# EAGLE design Schaltplan (EAGLE 7.3.0)
MAKER: Kevin Luedemann
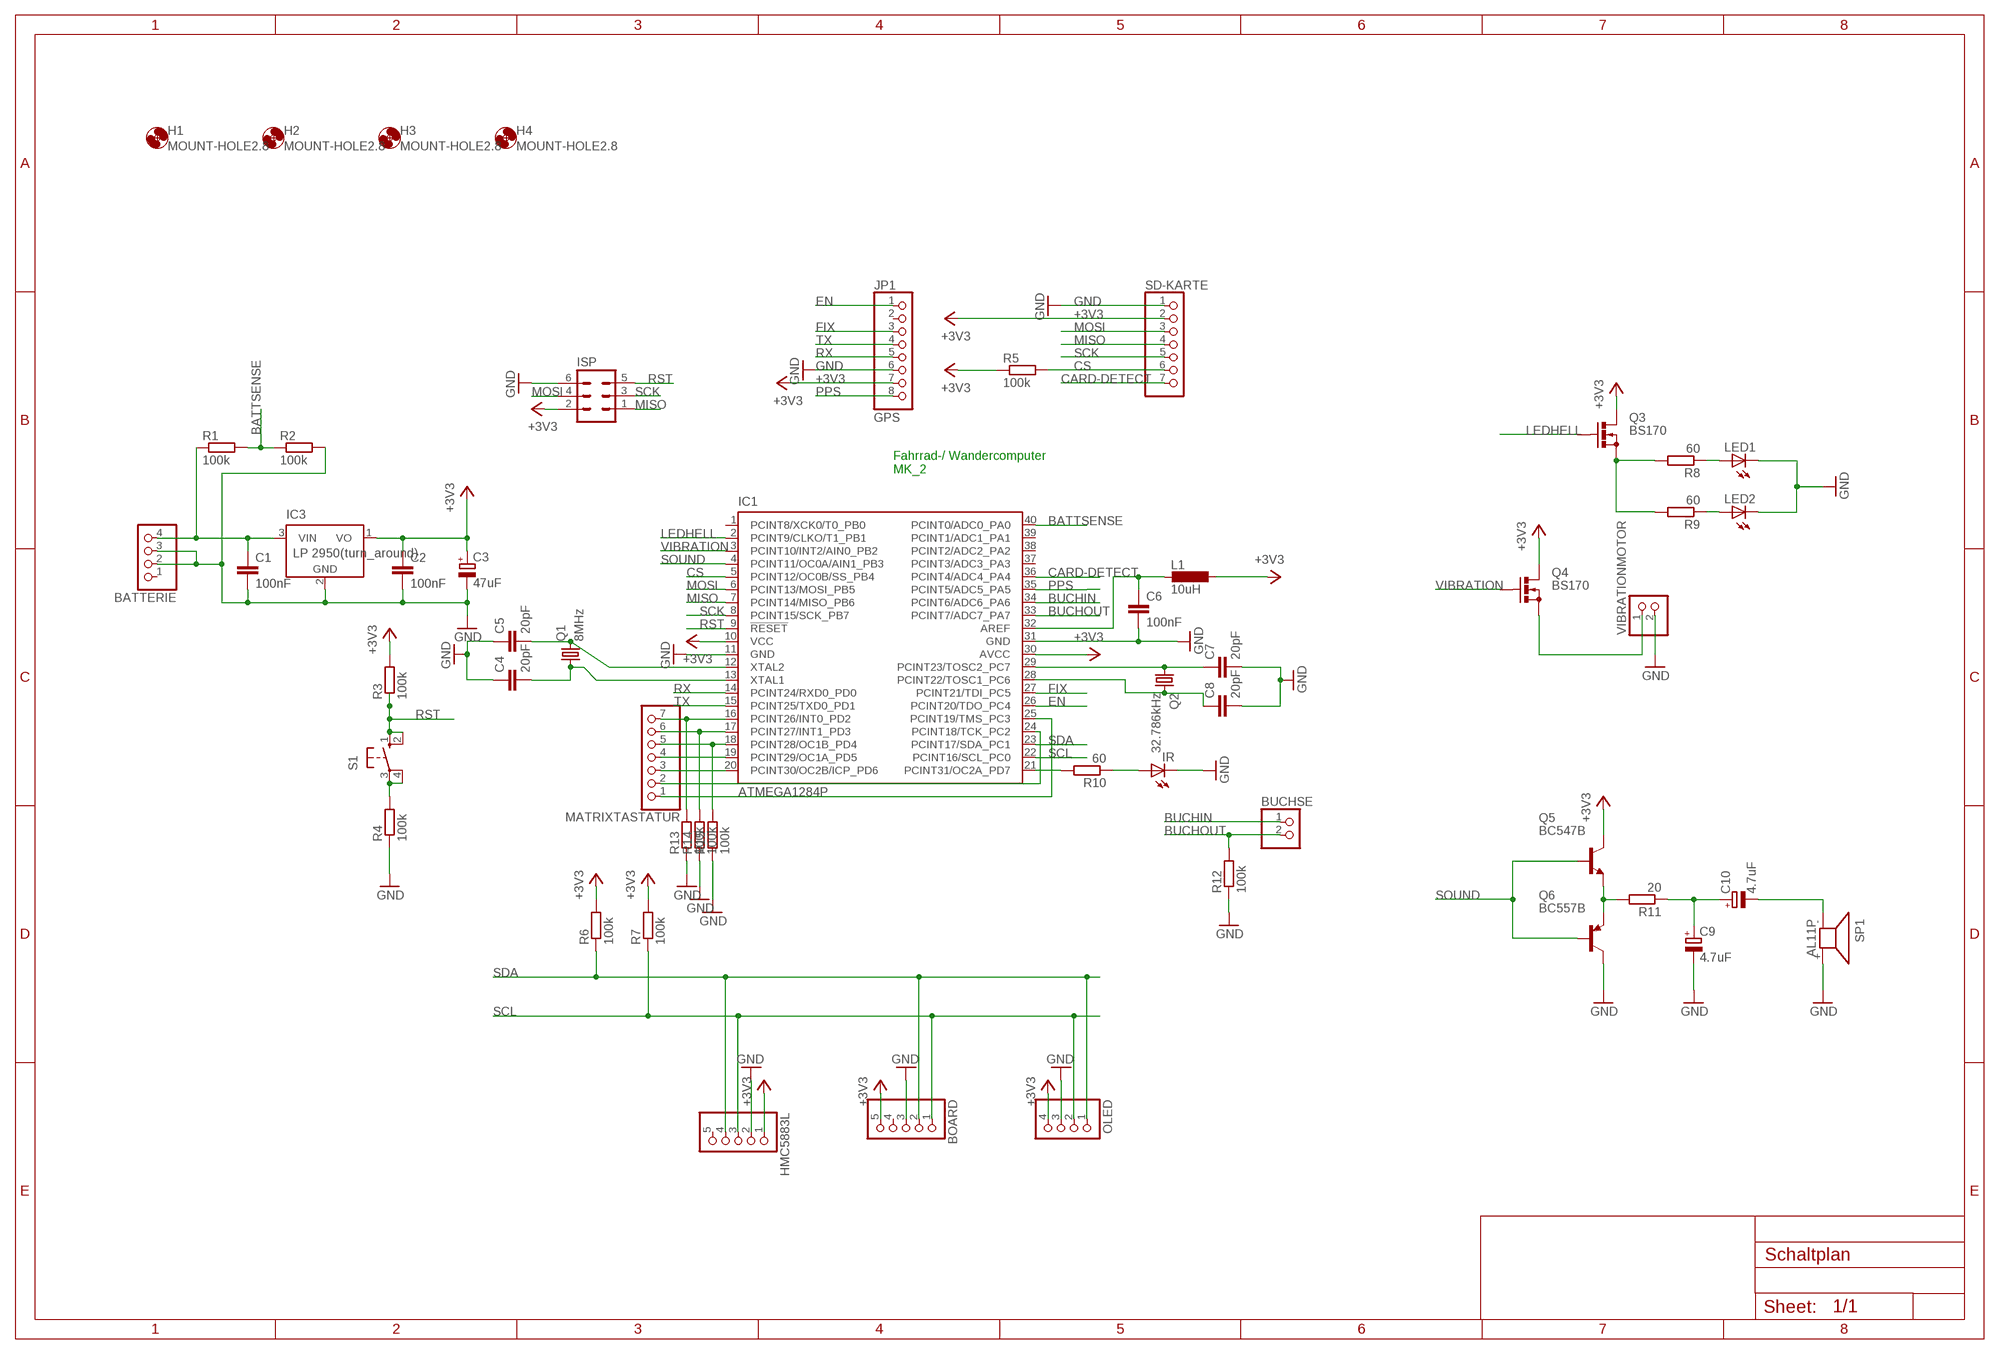
[diagram p0: schematic, sheet 1]

## Parts
BATTERIE  PINHD-1X4  [1X04]
BOARD  PINHD-1X5  [1X05]
BUCHSE  PINHD-1X2  [1X02]
C1  100nF  C-EU025-024X044  [C025-024X044]
C2  100nF  C-EU025-024X044  [C025-024X044]
C3  47uF  CPOL-EUE2.5-6  [E2,5-6]
C4  20pF  C-EU025-024X044  [C025-024X044]
C5  20pF  C-EU025-024X044  [C025-024X044]
C6  100nF  C-EU025-024X044  [C025-024X044]
C7  20pF  C-EU025-024X044  [C025-024X044]
C8  20pF  C-EU025-024X044  [C025-024X044]
C9  4.7uF  CPOL-EUE2.5-6  [E2,5-6]
C10  4.7uF  CPOL-EUE2.5-6  [E2,5-6]
H1  MOUNT-HOLE2.8  [2,8]
H2  MOUNT-HOLE2.8  [2,8]
H3  MOUNT-HOLE2.8  [2,8]
H4  MOUNT-HOLE2.8  [2,8]
HMC5883L  PINHD-1X5  [1X05]
IC1  ATMEGA1284P  ATMEGA644-20PU  [DIL40]
IC3  LP 2950(turn_around)  LM2936Z-3.0  [TO92]
IR  LED3MM  [LED3MM]
ISP  ML6  [ML6]
JP1  GPS  PINHD-1X8  [1X08]
L1  10uH  L-EU0207/10  [0207/10]
LED1  LED5MM  [LED5MM]
LED2  LED5MM  [LED5MM]
MATRIXTASTATUR  PINHD-1X7  [1X07]
OLED  PINHD-1X4  [1X04]
Q1  8MHz  CRYSTALHC49S  [HC49/S]
Q2  32.786kHz  CRYSTALTC26V  [TC26V]
Q3  BS170  [SOT54E]
Q4  BS170  [SOT54E]
Q5  BC547B  [TO92]
Q6  BC557B  [TO92-EBC]
R1  100k  R-EU_0207/10  [0207/10]
R2  100k  R-EU_0207/10  [0207/10]
R3  100k  R-EU_0207/10  [0207/10]
R4  100k  R-EU_0207/10  [0207/10]
R5  100k  R-EU_0207/10  [0207/10]
R6  100k  R-EU_0207/10  [0207/10]
R7  100k  R-EU_0207/10  [0207/10]
R8  60  R-EU_0207/10  [0207/10]
R9  60  R-EU_0207/10  [0207/10]
R10  60  R-EU_0207/10  [0207/10]
R11  20  R-EU_0207/10  [0207/10]
R12  100k  R-EU_0207/10  [0207/10]
R13  100k  R-EU_0207/10  [0207/10]
R14  100k  R-EU_0207/10  [0207/10]
R15  100k  R-EU_0207/10  [0207/10]
S1  10-XX  [B3F-10XX]
SD-KARTE  PINHD-1X7  [1X07]
SP1  AL11P  [AL11P]
VIBRATIONMOTOR  PINHD-1X2  [1X02]

## Nets
+3V3: BOARD.5 C2.1 C3.+ HMC5883L.1 IC1.10(VCC) IC1.30(AVCC) IC3.1(VO) ISP.2 JP1.7 L1.1 OLED.4 Q3.D Q4.D Q5.3(C) R3.2 R5.1 R6.2 R7.2 SD-KARTE.2
BATTSENSE: IC1.40(PCINT0/ADC0_PA0) R1.2 R2.1
BUCHIN: BUCHSE.1 IC1.34(PCINT6/ADC6_PA6)
BUCHOUT: BUCHSE.2 IC1.33(PCINT7/ADC7_PA7) R12.2
CARD-DETECT: IC1.36(PCINT4/ADC4_PA4) SD-KARTE.7
CS: IC1.5(PCINT12/OC0B/SS_PB4) R5.2 SD-KARTE.6
EN: IC1.26(PCINT20/TDO_PC4) JP1.1
FIX: IC1.27(PCINT21/TDI_PC5) JP1.3
GND: BATTERIE.2 BATTERIE.3 BOARD.3 C1.2 C2.2 C3.- C4.1 C5.1 C6.2 C7.2 C8.2 C9.- HMC5883L.2 IC1.11(GND) IC1.31(GND) IC3.2(GND) IR.K(C) ISP.6 JP1.6 LED1.K(C) LED2.K(C) OLED.3 Q6.C R2.2 R4.1 R12.1 R13.1 R14.1 R15.1 SD-KARTE.1 SP1.+ VIBRATIONMOTOR.2
LEDHELL: IC1.2(PCINT9/CLKO/T1_PB1) Q3.G
MISO: IC1.7(PCINT14/MISO_PB6) ISP.1 SD-KARTE.4
MOSI: IC1.6(PCINT13/MOSI_PB5) ISP.4 SD-KARTE.3
N$1: BATTERIE.4 C1.1 IC3.3(VIN) R1.1
N$2: C5.2 IC1.12(XTAL2) Q1.2
N$3: C7.1 IC1.29(PCINT23/TOSC2_PC7) Q2.1
N$4: C4.2 IC1.13(XTAL1) Q1.1
N$5: C8.1 IC1.28(PCINT22/TOSC1_PC6) Q2.2
N$6: R4.2 S1.3(P) S1.4(P1)
N$7: Q3.S R8.2 R9.2
N$8: C6.1 IC1.32(AREF) L1.2
N$9: LED1.A R8.1
N$10: LED2.A R9.1
N$11: IC1.16(PCINT26/INT0_PD2) MATRIXTASTATUR.7 R13.2
N$12: IC1.17(PCINT27/INT1_PD3) MATRIXTASTATUR.6 R14.2
N$13: IC1.18(PCINT28/OC1B_PD4) MATRIXTASTATUR.5 R15.2
N$14: Q4.S VIBRATIONMOTOR.1
N$15: IC1.19(PCINT29/OC1A_PD5) MATRIXTASTATUR.4
N$16: IC1.20(PCINT30/OC2B/ICP_PD6) MATRIXTASTATUR.3
N$17: IC1.24(PCINT18/TCK_PC2) MATRIXTASTATUR.2
N$18: IC1.25(PCINT19/TMS_PC3) MATRIXTASTATUR.1
N$19: IC1.21(PCINT31/OC2A_PD7) R10.2
N$20: IR.A R10.1
N$21: Q5.1(E) Q6.E R11.2
N$22: C9.+ C10.+ R11.1
N$23: C10.- SP1.-
PPS: IC1.35(PCINT5/ADC5_PA5) JP1.8
RST: IC1.9(!RESET) ISP.5 R3.1 S1.1(S) S1.2(S1)
RX: IC1.14(PCINT24/RXD0_PD0) JP1.5
SCK: IC1.8(PCINT15/SCK_PB7) ISP.3 SD-KARTE.5
SCL: BOARD.1 HMC5883L.3 IC1.22(PCINT16/SCL_PC0) OLED.2 R7.1
SDA: BOARD.2 HMC5883L.4 IC1.23(PCINT17/SDA_PC1) OLED.1 R6.1
SOUND: IC1.4(PCINT11/OC0A/AIN1_PB3) Q5.2(B) Q6.B
TX: IC1.15(PCINT25/TXD0_PD1) JP1.4
VIBRATION: IC1.3(PCINT10/INT2/AIN0_PB2) Q4.G
Unconnected: BATTERIE.1 BOARD.4 HMC5883L.5 IC1.1(PCINT8/XCK0/T0_PB0) IC1.37(PCINT3/ADC3_PA3) IC1.38(PCINT2/ADC2_PA2) IC1.39(PCINT1/ADC1_PA1) JP1.2

## Notes on the sheet
- Fahrrad-/ Wandercomputer
  MK_2

## Library data of the parts
BATTERIE OLED = pinhead:PINHD-1X4: PIN HEADER
BOARD HMC5883L = pinhead:PINHD-1X5: PIN HEADER
BUCHSE VIBRATIONMOTOR = pinhead:PINHD-1X2: PIN HEADER
C1 C2 C4-C8 = rcl:C-EU: CAPACITOR, European symbol
C3 C9 C10 = rcl:CPOL-EU: POLARIZED CAPACITOR, European symbol
H1-H4 = holes:MOUNT-HOLE: MOUNTING HOLE with drill center marker
IC1 = atmel:ATMEGA644-*PU: 8-bit Microcontroller with 64K Bytes In-System Programmable Flash Auto generated by make-symbol-device-package-bsdl.ulp Rev. 34 Source: http://www.atmel.com/dyn/resources/prod_documents/doc2593.pdf; MPN: ATMEGA644-20PU; OC_FARNELL: 1288340; OC_NEWARK: 23M5060
IC3 = national-semiconductor:LM2936?*: Ultra-Low Quiescent Current LDO Voltage Regulator Source: Data sheet <http://www.national.com/ds/LM/LM2936.pdf>; MF: NATIONAL SEMICONDUCTOR; MPN: LM2936Z-3.0/NOPB; OC_FARNELL: 1312709; OC_NEWARK: 41K4531
IR LED1 LED2 = led:LED: LED OSRAM: - CHIPLED LG R971, LG N971, LY N971, LG Q971, LY Q971, LO R971, LY R971 LH N974, LH R974 LS Q976, LO Q976, LY Q976 LO Q996 - Hyper CHIPLED LW Q18S LB Q993, LB Q99A, LB R99A - SideLED LS A670, LO A670, LY A670, LG A670, LP A670 LB A673, LV A673, LT A673, LW A673 LH A674 LY A675 LS A676, LA A676, LO A676, LY A676, LW A676 LS A679, LY A679, LG A679 - Hyper Micro SIDELED® LS Y876, LA Y876, LO Y876, LY Y876 LT Y87S - SmartLED LW L88C, LW L88S LB L89C, LB L89S, LG L890 LS L89K, LO L89K, LY L89K LS L896, LA L896, LO L896, LY L896 - TOPLED LS T670, LO T670, LY T670, LG T670, LP T670 LSG T670, LSP T670, LSY T670, LOP T670, LYG T670 LG T671, LOG T671, LSG T671 LB T673, LV T673, LT T673, LW T673 LH T674 LS T676, LA T676, LO T676, LY T676, LB T676, LH T676, LSB T676, LW T676 LB T67C, LV T67C, LT T67C, LS T67K, LO T67K, LY T67K, LW E67C LS E67B, LA E67B, LO E67B, LY E67B, LB E67C, LV E67C, LT E67C LW T67C LS T679, LY T679, LG T679 LS T770, LO T770, LY T770, LG T770, LP T770 LB T773, LV T773, LT T773, LW T773 LH T774 LS E675, LA E675, LY E675, LS T675 LS T776, LA T776, LO T776, LY T776, LB T776 LHGB T686 LT T68C, LB T68C - Hyper Mini TOPLED® LB M676 - Mini TOPLED Santana® LG M470 LS M47K, LO M47K, LY M47K Source: http://www.osram.convergy.de LUXEON: - LUMILED® LXK2-PW12-R00, LXK2-PW12-S00, LXK2-PW14-U00, LXK2-PW14-V00 LXK2-PM12-R00, LXK2-PM12-S00, LXK2-PM14-U00 LXK2-PE12-Q00, LXK2-PE12-R00, LXK2-PE12-S00, LXK2-PE14-T00, LXK2-PE14-U00 LXK2-PB12-K00, LXK2-PB12-L00, LXK2-PB12-M00, LXK2-PB14-N00, LXK2-PB14-P00, LXK2-PB14-Q00 LXK2-PR12-L00, LXK2-PR12-M00, LXK2-PR14-Q00, LXK2-PR14-R00 LXK2-PD12-Q00, LXK2-PD12-R00, LXK2-PD12-S00 LXK2-PH12-R00, LXK2-PH12-S00 LXK2-PL12-P00, LXK2-PL12-Q00, LXK2-PL12-R00 Source: www.luxeon.com KINGBRIGHT: KA-3528ASYC Source: www.kingbright.com
ISP = con-ml:ML6: HARTING; OC_FARNELL: unknown; OC_NEWARK: unknown
JP1 = pinhead:PINHD-1X8: PIN HEADER
L1 = rcl:L-EU: INDUCTOR, European symbol
MATRIXTASTATUR SD-KARTE = pinhead:PINHD-1X7: PIN HEADER
Q1 = crystal:CRYSTAL: CRYSTAL; OC_FARNELL: 1667008; OC_NEWARK: unknown
Q2 = crystal:CRYSTAL: CRYSTAL; OC_FARNELL: unknown; OC_NEWARK: unknown
Q3 Q4 = transistor-small-signal:BS170: N-CHANNEL MOS FET
Q5 = transistor-npn:BC547*: NPN Transistor
Q6 = transistor-pnp:BC557*: PNP Transistror
R1-R15 = rcl:R-EU_: RESISTOR, European symbol
S1 = switch-omron:10-XX: OMRON SWITCH; MPN: B3F-1000; OC_FARNELL: 176432; OC_NEWARK: 36M3542
SP1 = buzzer:AL11P: SPEAKER Source: Buerklin; OC_FARNELL: unknown; OC_NEWARK: unknown

## Board
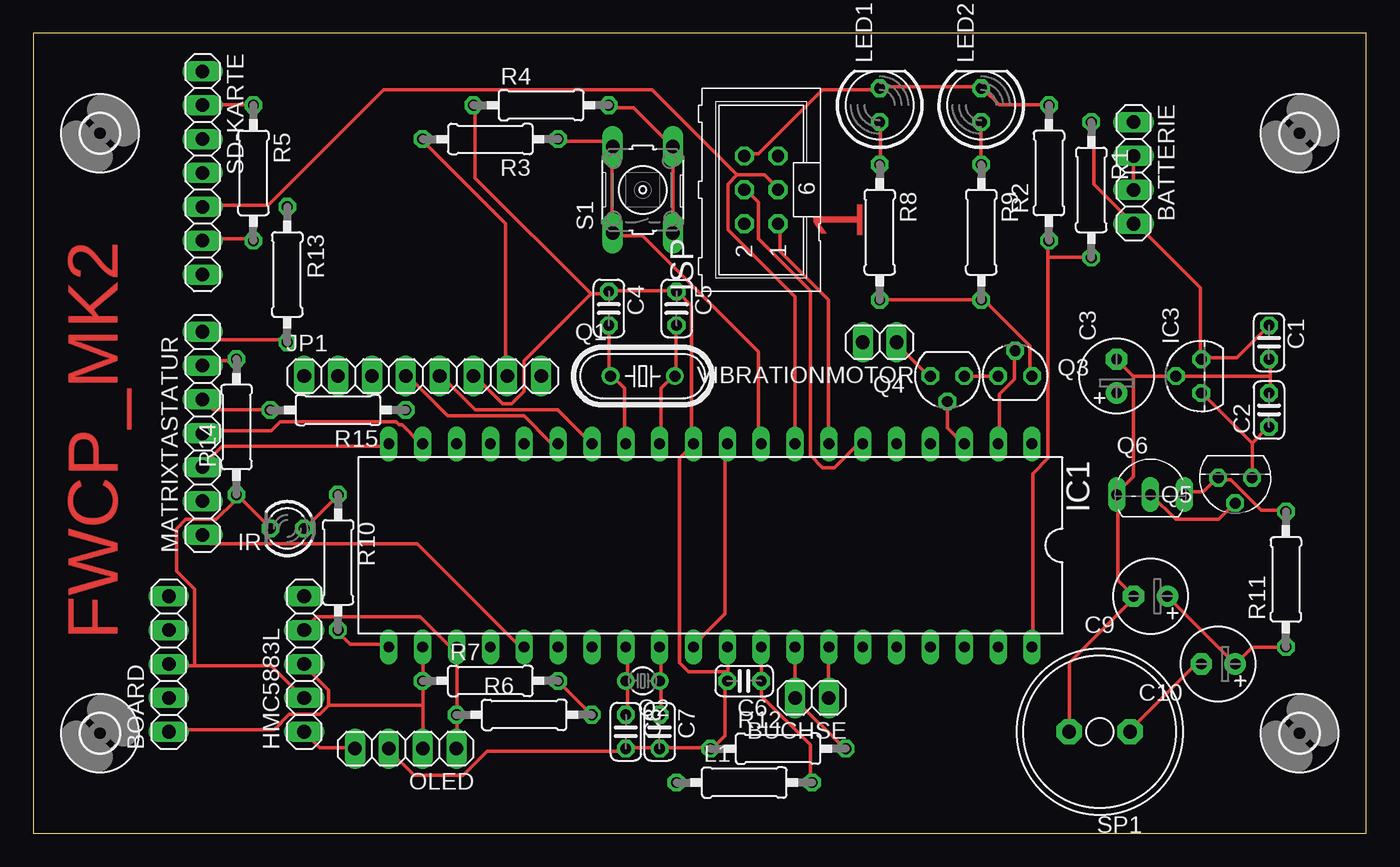
[diagram p1: board, top side]
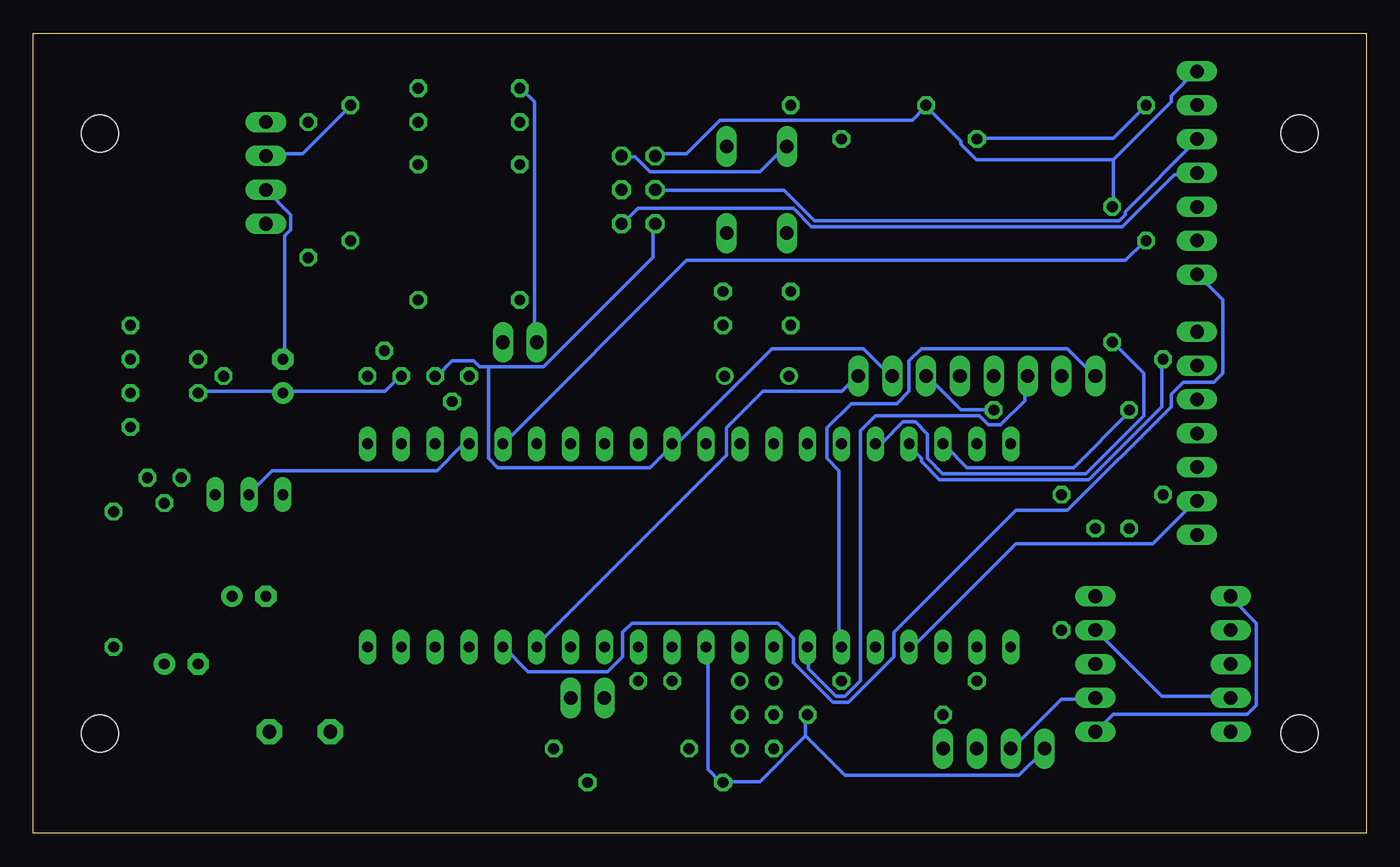
[diagram p2: board, bottom side, seen from below]

Size 100 x 60 mm. Coordinates in mm from the lower left corner, seen from the top.
Outline: 0,0 100,0 100,60 0,60 0,0
Copper layers (1*16): Top 0.035mm / dielectric 1.5mm / Bottom 0.035mm
Design rules "default": minimum track width 10mil, minimum drill 24mil, track to track 8mil, track to pad 8mil, pad to pad 8mil, via to via 8mil, smd to smd 8mil, copper to edge 40mil, drill to drill 8mil, minimum pad ring 10mil, minimum via ring 8mil, stop-mask expansion 4mil, vias tented up to drill 0mil, thermal gap 10mil

### Footprints (pad centres in the part's own frame; a part is rotated, then mirrored left to right if it is on the bottom)
1X04 = drill 1.016 long: 1 -3.81,0; 2 -1.27,0; 3 1.27,0; 4 3.81,0
1X05 = drill 1.016 long: 1 -5.08,0; 2 -2.54,0; 3 0,0; 4 2.54,0; 5 5.08,0
1X02 = drill 1.016 long: 1 -1.27,0; 2 1.27,0
C025-024X044 = drill 0.813 octagon: 1 -1.27,0; 2 1.27,0
E2,5-6 = drill 0.813 pad 1.6: + -1.27,0 | drill 0.813 pad 1.6 octagon: - 1.27,0
2,8 = hole 2.8: 0,0
DIL40 = drill 0.813 long: 1 -24.13,-7.62; 2 -21.59,-7.62; 3 -19.05,-7.62; 4 -16.51,-7.62; 5 -13.97,-7.62; 6 -11.43,-7.62; 7 -8.89,-7.62; 8 -6.35,-7.62; 9 -3.81,-7.62; 10 -1.27,-7.62; 11 1.27,-7.62; 12 3.81,-7.62; 13 6.35,-7.62; 14 8.89,-7.62; 15 11.43,-7.62; 16 13.97,-7.62; 17 16.51,-7.62; 18 19.05,-7.62; 19 21.59,-7.62; 20 24.13,-7.62; 21 24.13,7.62; 22 21.59,7.62; 23 19.05,7.62; 24 16.51,7.62; 25 13.97,7.62; 26 11.43,7.62; 27 8.89,7.62; 28 6.35,7.62; 29 3.81,7.62; 30 1.27,7.62; 31 -1.27,7.62; 32 -3.81,7.62; 33 -6.35,7.62; 34 -8.89,7.62; 35 -11.43,7.62; 36 -13.97,7.62; 37 -16.51,7.62; 38 -19.05,7.62; 39 -21.59,7.62; 40 -24.13,7.62
TO92 = drill 0.813 pad 1.27 octagon: 1 -1.27,0; 2 0,1.905; 3 1.27,0
LED3MM = drill 0.813 octagon: A -1.27,0; K 1.27,0
ML6 = drill 0.914 octagon: 1 -2.54,-1.27; 2 -2.54,1.27; 3 0,-1.27; 4 0,1.27; 5 2.54,-1.27; 6 2.54,1.27
1X08 = drill 1.016 long: 1 -8.89,0; 2 -6.35,0; 3 -3.81,0; 4 -1.27,0; 5 1.27,0; 6 3.81,0; 7 6.35,0; 8 8.89,0
0207/10 = drill 0.813 octagon: 1 -5.08,0; 2 5.08,0
LED5MM = drill 0.813 octagon: A -1.27,0; K 1.27,0
1X07 = drill 1.016 long: 1 -7.62,0; 2 -5.08,0; 3 -2.54,0; 4 0,0; 5 2.54,0; 6 5.08,0; 7 7.62,0
HC49/S = drill 0.813: 1 -2.413,0; 2 2.413,0
TC26V = drill 0.813: 1 -1.27,0; 2 1.27,0
SOT54E = drill 0.813 octagon: D -1.27,0; G 0,1.905; S 1.27,0
TO92' = drill 0.813 octagon: 1 1.27,0; 2 0,1.905; 3 -1.27,0
TO92-EBC = drill 0.813 long: B 0,-1.27; C -2.54,-1.27; E 2.54,-1.27
B3F-10XX = drill 1.016 long: 1 -3.251,2.261; 2 3.251,2.261; 3 -3.251,-2.261; 4 3.251,-2.261
AL11P = drill 1.016 pad 1.905 octagon: + 2.286,0; - -2.286,0

### Placement (x,y rotation side)
BATTERIE  82.55,49.53 270 top
BOARD  10.16,12.7 90 top
BUCHSE  58.42,10.16 180 top
C1  92.71,36.83 270 top
C2  92.71,31.75 90 top
C3  81.28,34.29 90 top
C4  43.18,39.37 270 top
C5  48.26,39.37 270 top
C6  53.34,11.43 180 top
C7  46.99,7.62 270 top
C8  44.45,7.62 270 top
C9  83.82,17.78 180 top
C10  88.9,12.7 180 top
H1  5,7.5 0 top
H2  95,7.5 0 top
H3  5,52.5 0 top
H4  95,52.5 0 top
HMC5883L  20.32,12.7 90 top
IC1  50.8,21.59 180 top
IC3  87.63,34.29 90 top
IR  19.05,22.86 180 top
ISP  54.61,48.26 90 top
JP1  29.21,34.29 0 top
L1  53.34,3.81 0 top
LED1  63.5,54.61 90 top
LED2  71.12,54.61 90 top
MATRIXTASTATUR  12.7,30 90 top
OLED  27.94,6.35 180 top
Q1  45.72,34.29 0 top
Q2  45.72,11.43 180 top
Q3  73.66,34.29 0 top
Q4  68.58,34.29 180 top
Q5  BC547B  [TO92']  90.17,26.67 180 top
Q6  83.82,26.67 0 top
R1  79.38,48.26 270 top
R2  76.2,49.53 90 top
R3  34.29,52.07 180 top
R4  38.1,54.61 0 top
R5  16.51,49.53 270 top
R6  36.83,8.89 0 top
R7  34.29,11.43 0 top
R8  63.5,45.09 270 top
R9  71.12,45.09 270 top
R10  22.86,20.32 270 top
R11  93.98,19.05 90 top
R12  55.88,6.35 0 top
R13  19.05,41.91 270 top
R14  15.24,30.48 90 top
R15  22.86,31.75 180 top
S1  45.72,48.26 90 top
SD-KARTE  12.7,49.53 270 top
SP1  80.01,7.62 180 top
VIBRATIONMOTOR  63.5,36.83 180 top

### Tracks (layer width: path | path; a pad name or v marks a point on that pad's centre or on a via)
+3V3
  Top 0.254: 91.44,29.26 Q5.3 | 91.44,29.26 92.58,30.4 C2.1 | 91.44,29.26 87.78,32.92 IC3.1 | Q3.D Q4.D | R5.1 16.46,54.63 12.8,54.63 SD-KARTE.2 | JP1.7 35.43,34.29 35.43,45.72 29.26,51.89 R3.2 | OLED.4 24,6.4 21.49,6.4 20.34,7.54 HMC5883L.1 | R6.2 41.83,8.91 39.32,11.43 R7.2 | IC1.10 51.89,29.03 51.89,16.46 49.61,14.17 IC1.30
  Bottom 0.254: IC3.1 87.55,33.15 81.38,33.15 C3.+ 81.15,33.15 73.61,33.15 72.47,34.29 Q3.D | 65.84,34.98 66.52,34.98 66.98,35.43 68.58,35.43 69.72,34.29 Q4.D | 65.84,34.98 61.72,34.98 53.49,43.2 53.49,45.72 ISP.2 | R3.2 29.03,52.12 18.97,52.12 16.69,54.41 R5.1 | BOARD.5 10.06,17.6 8.23,15.77 8.23,9.6 8.91,8.91 18.97,8.91 20.12,7.77 HMC5883L.1 | 42.06,7.32 45.49,3.89 48.23,3.89 L1.1 48.46,3.89 49.38,4.8 49.38,13.95 IC1.30 | 42.06,7.32 42.06,8.69 R6.2 | 42.06,7.32 39.09,4.34 26.06,4.34 24.23,6.17 OLED.4 | JP1.7 35.66,34.29 37.72,36.35 44.58,36.35 51.89,29.03 IC1.10 52.12,29.03 53.72,27.43 65.15,27.43 65.84,28.12 65.84,34.98
BATTSENSE
  Top 0.254: 76.12,43.2 76.12,44.35 R2.1 | 76.12,43.2 76.12,28.12 74.98,26.98 74.98,14.17 IC1.40 | 76.12,43.2 79.32,43.2 R1.2
BUCHIN
  Top 0.254: IC1.34 59.66,13.95 59.66,10.29 BUCHSE.1
BUCHOUT
  Top 0.254: IC1.33 BUCHSE.2 57.15,10.06 60.81,6.4 R12.2
CARD-DETECT
  Bottom 0.254: IC1.36 64.69,13.95 62.87,12.12 56.92,12.12 55.78,13.26 55.78,15.09 55.09,15.77 44.12,15.77 42.98,14.63 42.98,12.8 40.01,9.83 38.86,9.83 35.43,13.26 35.43,15.09 26.29,24.23 22.4,24.23 14.63,32 14.63,32.92 13.72,33.83 11.43,33.83 10.74,34.52 10.74,40.01 12.57,41.83 SD-KARTE.7
CS
  Top 0.254: R5.2 16.46,44.58 12.8,44.58 SD-KARTE.6
  Bottom 0.254: IC1.5 64.69,29.26 50.98,42.98 18.06,42.98 16.69,44.35 R5.2
EN
  Bottom 0.254: IC1.26 39.55,14.17 39.55,27.2 40.46,28.12 40.46,30.4 38.63,32.23 35.2,32.23 34.29,33.15 34.29,35.43 33.38,36.35 22.4,36.35 20.34,34.29 JP1.1
FIX
  Bottom 0.254: IC1.27 41.83,13.95 41.83,12.34 39.78,10.29 39.09,10.29 37.95,11.43 37.95,30.18 36.8,31.32 29.03,31.32 28.35,30.63 27.43,30.63 25.6,32.46 25.6,34.29 JP1.3
GND
  Top 0.254: 92.81,34.29 92.81,35.43 C1.2 | 92.81,34.29 92.81,33.15 C2.2 | 82.53,34.29 IC3.2 92.81,34.29 | 82.53,34.29 81.38,35.43 C3.- | SP1.+ 77.72,12.8 82.53,17.6 C9.- 82.53,17.83 81.38,18.97 81.38,25.38 Q6.C 81.38,25.6 82.53,26.75 82.53,34.29 | BATTERIE.3 82.53,48.46 82.53,50.75 BATTERIE.2 | R2.2 76.12,54.63 72.47,54.63 71.32,55.78 LED2.K 71.09,56.01 63.55,56.01 LED1.K 63.32,55.78 59.21,55.78 54.41,50.98 53.49,50.98 ISP.6 | 52.12,12.12 52.12,13.95 IC1.31 | 52.12,12.12 52.12,11.43 C6.2 51.89,11.43 51.89,7.32 50.98,6.4 R12.1 50.75,6.4 47.09,6.4 C7.2 46.86,6.4 44.58,6.4 C8.2 44.35,6.17 34.06,6.17 32.23,4.34 28.57,4.34 26.75,6.17 OLED.3 | IR.K 17.83,22.86 15.32,25.38 R14.1 15.09,25.38 15.09,24.92 13.72,23.55 11.43,23.55 10.74,22.86 10.74,19.66 12.12,18.29 12.12,12.57 | 12.12,12.57 17.83,12.57 20.12,10.29 HMC5883L.2 | 12.12,12.57 10.29,12.57 BOARD.3 | 41.83,40.46 36.8,35.43 36.8,33.15 35.89,32.23 35.2,32.23 33.15,34.29 JP1.6 | 41.83,40.46 42.98,40.46 C4.1 43.2,40.69 48.23,40.69 C5.1 48.46,40.46 49.38,39.55 49.38,29.26 IC1.11 49.38,29.03 48.46,28.12 48.46,12.8 49.15,12.12 52.12,12.12 | 41.83,40.46 33.15,49.15 33.15,54.41 R4.1
  Bottom 0.254: VIBRATIONMOTOR.2 62.41,37.03 62.41,54.86 63.32,55.78 LED1.K | BATTERIE.2 82.53,50.98 79.78,50.98 76.35,54.41 R2.2 | BATTERIE.3 80.7,46.41 80.7,45.26 81.15,44.81 81.15,35.66 C3.- | OLED.3 26.52,6.4 22.86,10.06 20.34,10.06 HMC5883L.2 | 18.97,50.52 18.97,47.09 R13.1 | 18.97,50.52 14.63,54.86 14.63,55.32 12.8,57.15 SD-KARTE.1 | 18.97,50.52 29.26,50.52 30.4,51.66 30.4,51.89 32.92,54.41 R4.1 33.15,54.41 34.06,53.49 48.46,53.49 50.98,50.98 53.26,50.98 ISP.6 | R15.1 28.12,31.77 30.4,31.77 32.92,34.29 JP1.6
LEDHELL
  Top 0.254: IC1.2 72.47,29.26 72.47,32.92 73.61,34.06 73.61,36.12 Q3.G
MISO
  Top 0.254: IC1.7 59.66,29.26 59.66,40.01 56.01,43.66 56.01,45.72 ISP.1
  Bottom 0.254: SD-KARTE.4 12.8,49.38 14.4,49.38 18.29,45.49 41.6,45.49 42.98,46.86 54.63,46.86 55.78,45.72 ISP.1
MOSI
  Top 0.254: IC1.6 62.18,29.03 61.72,29.03 60.12,27.43 59.21,27.43 58.29,28.35 58.29,40.69 54.41,44.58 54.41,47.32 53.49,48.23 ISP.4
  Bottom 0.254: SD-KARTE.3 12.8,51.89 18.06,46.63 18.06,46.41 18.52,45.95 41.38,45.95 43.66,48.23 53.26,48.23 ISP.4
N$1
  Top 0.254: C1.1 92.58,37.95 90.3,35.66 87.78,35.66 IC3.3 87.55,35.66 87.55,40.92 82.75,45.72 BATTERIE.4 82.53,45.72 79.55,48.69 79.55,53.26 R1.1
N$2
  Top 0.254: IC1.12 47.09,29.26 47.09,33.38 48.01,34.29 Q1.2 48.23,34.29 48.23,37.95 C5.2
N$3
  Top 0.254: 47.09,11.43 47.09,8.91 C7.1 | 47.09,11.43 47.09,13.95 IC1.29 | 47.09,11.43 Q2.1
N$4
  Top 0.254: C4.2 43.2,37.95 43.2,34.29 Q1.1 43.43,34.29 44.35,33.38 44.35,29.26 IC1.13
N$5
  Top 0.254: 44.58,11.43 44.58,8.91 C8.1 | 44.58,11.43 44.58,13.95 IC1.28 | 44.58,11.43 Q2.2
N$6
  Top 0.254: R4.2 43.2,54.41 45.03,54.41 47.78,51.66 S1.4 48.01,51.44 48.01,45.03 S1.3
N$7
  Top 0.254: Q3.S 74.75,34.29 74.75,36.58 71.32,40.01 R9.2 R8.2
N$8
  Top 0.254: 54.63,11.43 54.63,13.95 IC1.32 | 54.63,11.43 54.63,10.29 58.29,6.63 58.29,3.89 L1.2 | 54.63,11.43 C6.1
N$9
  Top 0.254: R8.1 63.55,50.29 63.55,53.26 LED1.A
N$10
  Top 0.254: R9.1 71.09,50.29 71.09,53.26 LED2.A
N$11
  Top 0.254: R13.2 18.97,37.03 13.26,37.03 12.8,37.49 MATRIXTASTATUR.7
  Bottom 0.254: IC1.16 36.8,29.26 36.35,29.26 34.75,30.86 33.83,30.86 32.92,29.95 32.92,28.12 31.77,26.98 21.03,26.98 16.69,31.32 16.69,34.52 18.97,36.8 R13.2
N$12
  Top 0.254: R14.2 15.09,35.43 13.03,35.43 12.8,35.2 MATRIXTASTATUR.6
  Bottom 0.254: IC1.17 34.29,29.03 33.38,28.12 33.38,27.89 32,26.52 20.8,26.52 15.32,32 15.32,35.43 R14.2
N$13
  Top 0.254: R15.2 17.6,31.77 13.49,31.77 12.8,32.46 MATRIXTASTATUR.5
  Bottom 0.254: IC1.18 31.55,29.03 29.95,27.43 21.95,27.43 17.83,31.55 R15.2
N$14
  Top 0.254: Q4.S 67.21,34.29 64.69,36.8 VIBRATIONMOTOR.1
N$15
  Top 0.254: IC1.19 29.03,29.26 27.66,30.63 27.43,30.63 27.2,30.86 18.52,30.86 17.83,30.18 12.8,30.18 MATRIXTASTATUR.4
N$16
  Top 0.254: IC1.20 26.52,29.03 14.17,29.03 12.8,27.66 MATRIXTASTATUR.3
N$17
  Bottom 0.254: IC1.24 34.29,14.17 33.83,14.17 26.29,21.72 16,21.72 12.8,24.92 MATRIXTASTATUR.2
N$18
  Top 0.254: IC1.25 36.8,14.17 36.35,14.17 28.8,21.72 13.26,21.72 12.8,22.17 MATRIXTASTATUR.1
N$19
  Top 0.254: IC1.21 26.52,14.17 23.77,14.17 22.86,15.09 R10.2
N$20
  Top 0.254: IR.A 20.34,22.86 22.86,25.38 R10.1
N$21
  Top 0.254: Q6.E 86.41,25.6 87.78,25.6 88.7,26.52 Q5.1 88.92,26.52 89.84,26.52 92.13,24.23 93.95,24.23 R11.2
N$22
  Top 0.254: R11.1 93.95,13.95 91.44,13.95 90.3,12.8 C10.+ C9.+
N$23
  Top 0.254: C10.- 87.55,12.57 87.1,12.57 82.3,7.77 SP1.-
PPS
  Bottom 0.254: IC1.35 62.18,14.17 48.01,28.35 48.01,30.4 45.26,33.15 39.32,33.15 38.18,34.29 JP1.8
RST
  Top 0.254: R3.1 39.55,51.89 43.2,51.89 43.43,51.66 S1.2 43.43,51.44 43.43,45.03 S1.1 43.66,44.81 45.72,44.81 54.41,36.12 54.41,29.26 IC1.9
  Bottom 0.254: ISP.5 55.78,50.75 54.86,50.75 53.72,49.61 45.49,49.61 43.66,51.44 S1.2
RX
  Top 0.254: IC1.14 41.83,29.26 39.32,31.77 33.15,31.77 30.63,34.29 JP1.5
SCK
  Top 0.254: IC1.8 57.15,40.23 52.12,45.26 52.12,48.69 52.81,49.38 | 52.81,49.38 54.86,49.38 55.78,48.46 ISP.3 | 52.81,49.38 46.41,55.78 26.29,55.78 17.6,47.09 12.8,47.09 SD-KARTE.5
SCL
  Top 0.254: 29.26,11.43 29.26,13.95 IC1.22 | 29.26,11.43 29.26,9.6 | 29.26,9.6 29.26,6.4 OLED.2 | 29.26,11.43 R7.1 | 22.17,9.6 21.49,8.91 19.2,8.91 18.06,7.77 10.29,7.77 BOARD.1 | 22.17,9.6 22.17,10.74 20.34,12.57 HMC5883L.3 | 22.17,9.6 29.26,9.6
SDA
  Top 0.254: OLED.1 31.77,6.4 31.77,8.69 R6.1 31.77,8.91 31.77,13.95 IC1.23 31.55,14.17 31.09,14.17 29.03,16.23 21.26,16.23 20.34,15.32 HMC5883L.4
  Bottom 0.254: BOARD.2 10.29,10.29 15.32,10.29 20.12,15.09 HMC5883L.4
SOUND
  Top 0.254: Q6.B 83.9,25.38 85.72,23.55 88.92,23.55 90.07,24.69 Q5.2
  Bottom 0.254: IC1.4 67.44,29.03 67.89,29.03 69.72,27.2 82.07,27.2 83.67,25.6 Q6.B
TX
  Top 0.254: IC1.15 39.32,29.26 38.86,29.26 36.8,31.32 31.09,31.32 28.12,34.29 JP1.4
VIBRATION
  Top 0.254: Q4.G 68.58,30.4 69.72,29.26 IC1.3

### Text on the board
Top: FWCP_MK2 | 1